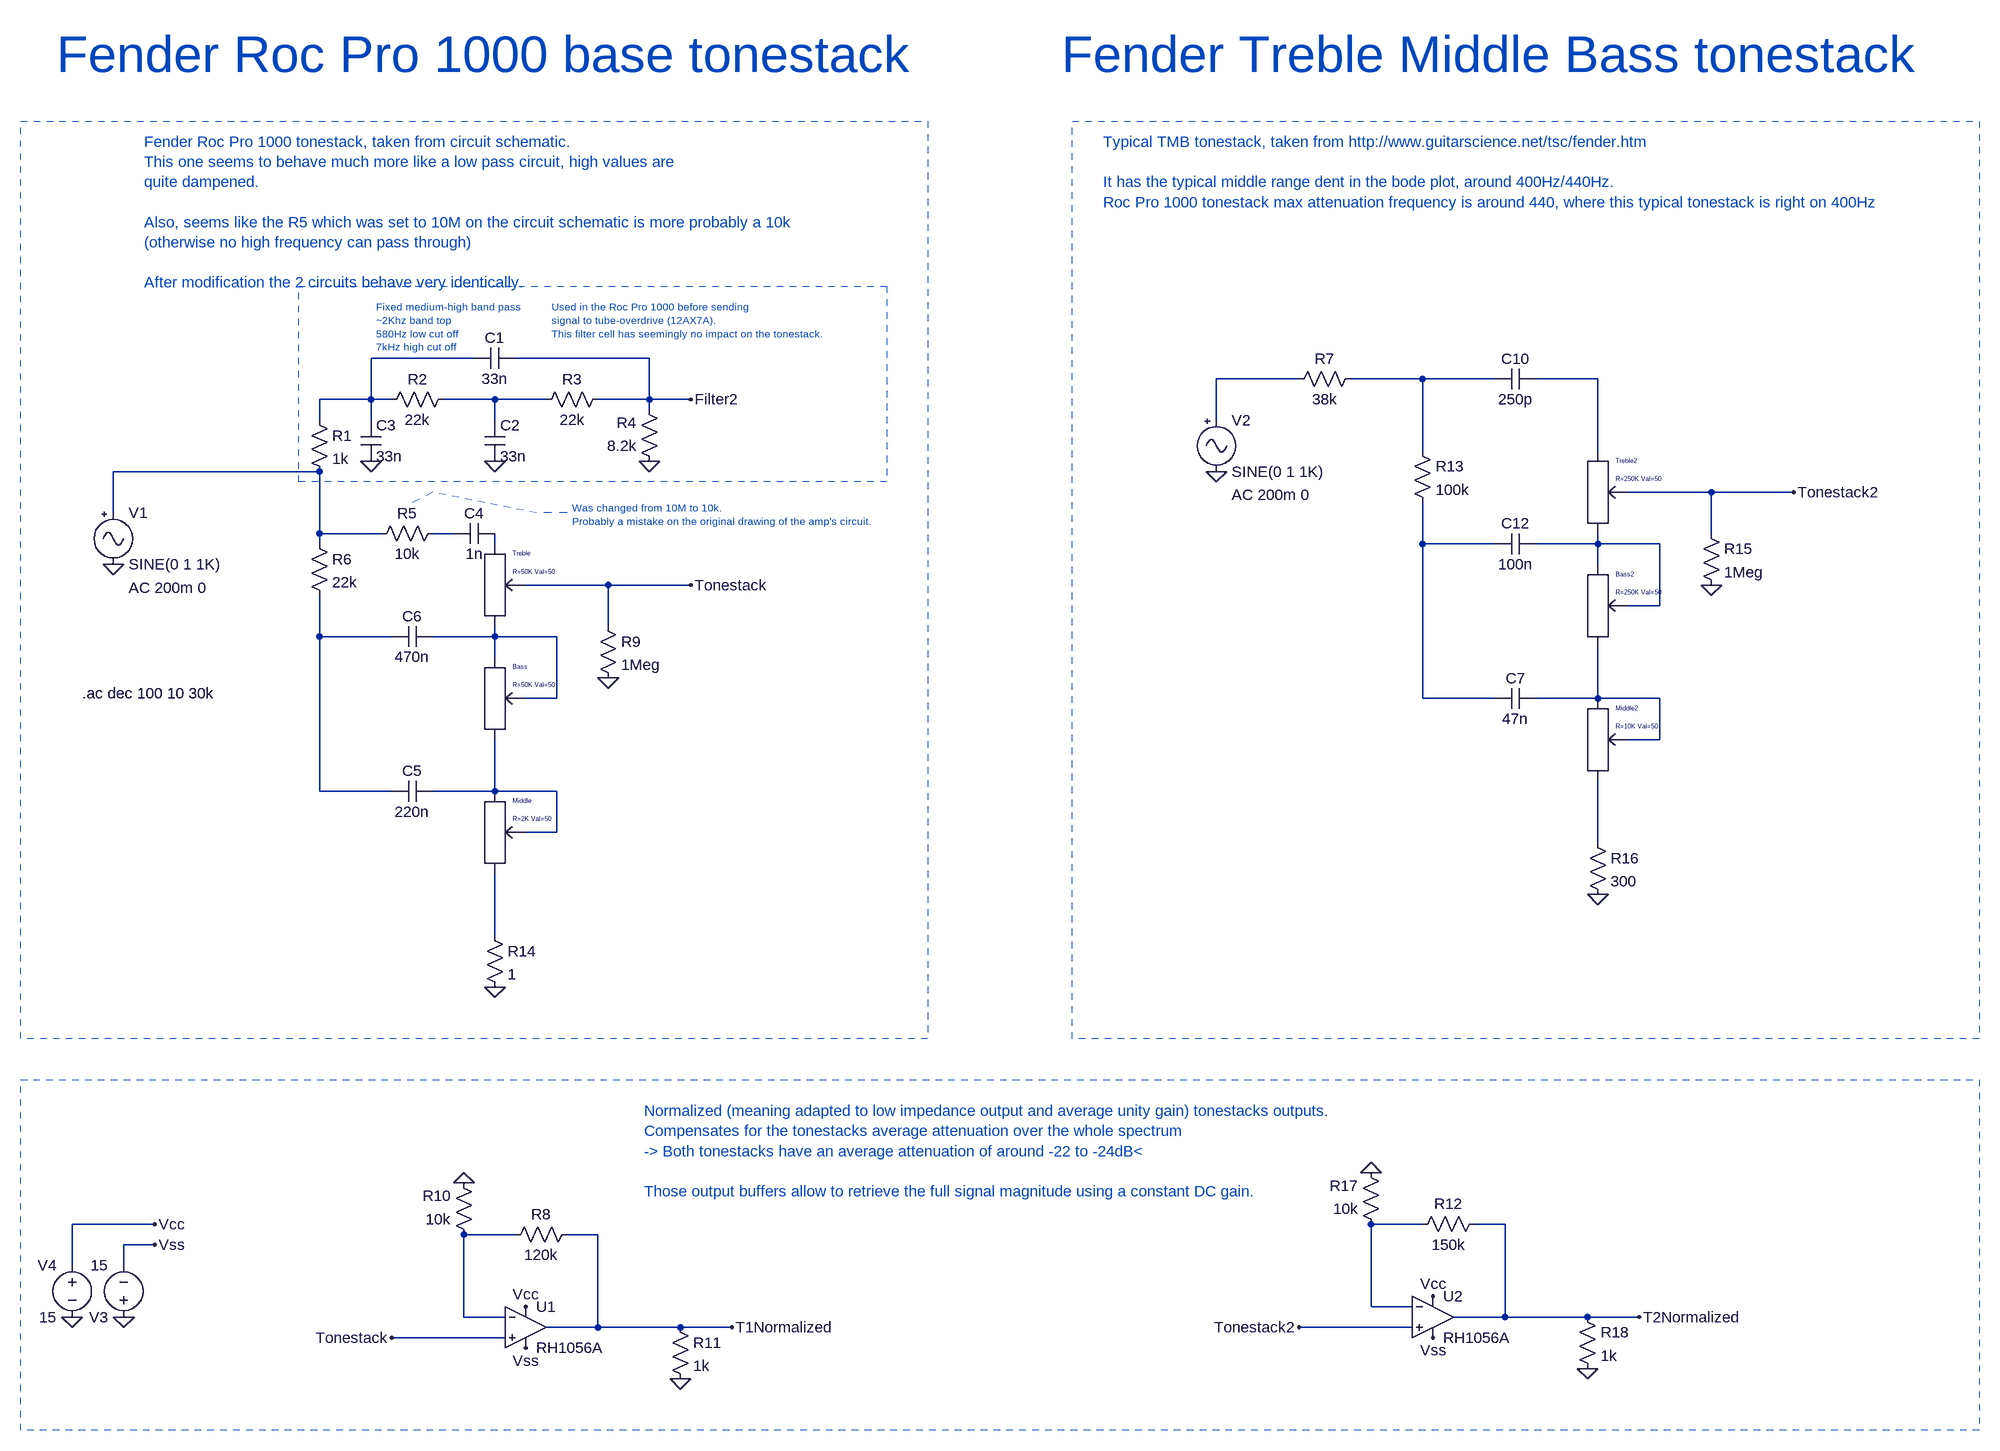
[diagram p0: schematic FenderToneStack.asc]
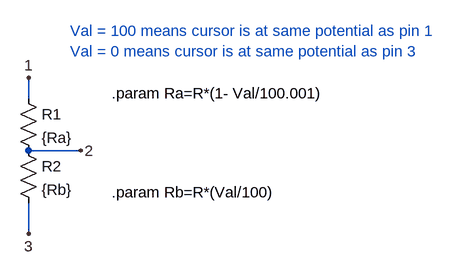
[diagram p1: sub-circuit potentiometer.asc]
FenderToneStack.asc, the LTspice schematic file:
Version 4
SHEET 1 3704 1716
WIRE 144 48 -16 48
WIRE 416 48 208 48
WIRE 1424 80 1296 80
WIRE 1616 80 1504 80
WIRE 1728 80 1616 80
WIRE 1888 80 1792 80
WIRE -16 112 -16 48
WIRE -16 112 -96 112
WIRE 16 112 -16 112
WIRE 176 112 96 112
WIRE 256 112 176 112
WIRE 416 112 416 48
WIRE 416 112 336 112
WIRE 480 112 416 112
WIRE 416 128 416 112
WIRE -96 144 -96 112
WIRE -16 144 -16 112
WIRE 176 144 176 112
WIRE 1296 144 1296 80
WIRE 1616 192 1616 80
WIRE 1888 192 1888 80
WIRE -96 224 -416 224
WIRE 2064 256 1936 256
WIRE 2192 256 2064 256
WIRE -416 288 -416 224
WIRE -96 320 -96 224
WIRE 0 320 -96 320
WIRE 112 320 80 320
WIRE 2064 320 2064 256
WIRE -96 336 -96 320
WIRE 176 336 176 320
WIRE 1616 336 1616 272
WIRE 1728 336 1616 336
WIRE 1888 336 1888 320
WIRE 1888 336 1792 336
WIRE 1984 336 1888 336
WIRE 1888 368 1888 336
WIRE 352 400 224 400
WIRE 480 400 352 400
WIRE 1984 432 1984 336
WIRE 1984 432 1936 432
WIRE 352 464 352 400
WIRE -96 480 -96 416
WIRE 16 480 -96 480
WIRE 176 480 176 464
WIRE 176 480 80 480
WIRE 272 480 176 480
WIRE 176 512 176 480
WIRE 272 576 272 480
WIRE 272 576 224 576
WIRE 1616 576 1616 336
WIRE 1728 576 1616 576
WIRE 1888 576 1888 496
WIRE 1888 576 1792 576
WIRE 1984 576 1888 576
WIRE 1984 640 1984 576
WIRE 1984 640 1936 640
WIRE -96 720 -96 480
WIRE 16 720 -96 720
WIRE 176 720 176 640
WIRE 176 720 80 720
WIRE 272 720 176 720
WIRE 272 784 272 720
WIRE 272 784 224 784
WIRE 1888 800 1888 704
WIRE 176 944 176 848
WIRE -352 1392 -480 1392
WIRE 1616 1392 1536 1392
WIRE 1744 1392 1696 1392
WIRE 208 1408 128 1408
WIRE 336 1408 288 1408
WIRE -352 1424 -400 1424
WIRE -480 1456 -480 1392
WIRE -400 1456 -400 1424
WIRE 1536 1520 1536 1392
WIRE 1600 1520 1536 1520
WIRE 128 1536 128 1408
WIRE 192 1536 128 1536
WIRE 1744 1536 1744 1392
WIRE 1744 1536 1664 1536
WIRE 1872 1536 1744 1536
WIRE 1952 1536 1872 1536
WIRE 336 1552 336 1408
WIRE 336 1552 256 1552
WIRE 464 1552 336 1552
WIRE 544 1552 464 1552
WIRE 1600 1552 1424 1552
WIRE 192 1568 16 1568
FLAG -16 208 0
FLAG 176 208 0
FLAG 416 208 0
FLAG 352 544 0
FLAG 176 1024 0
FLAG -416 368 0
FLAG 480 112 Filter2
FLAG 480 400 Tonestack
FLAG 2064 400 0
FLAG 1888 880 0
FLAG 1296 224 0
FLAG 2192 256 Tonestack2
FLAG 16 1568 Tonestack
FLAG 128 1328 0
FLAG -480 1536 0
FLAG -400 1536 0
FLAG -352 1392 Vcc
FLAG -352 1424 Vss
FLAG 224 1584 Vss
FLAG 224 1520 Vcc
FLAG 464 1632 0
FLAG 544 1552 T1Normalized
FLAG 1424 1552 Tonestack2
FLAG 1536 1312 0
FLAG 1632 1568 Vss
FLAG 1632 1504 Vcc
FLAG 1872 1616 0
FLAG 1952 1536 T2Normalized
SYMBOL Misc\\signal -416 272 R0
WINDOW 123 24 132 Left 2
WINDOW 39 0 0 Left 0
SYMATTR InstName V1
SYMATTR Value2 AC 200m 0
SYMBOL res -112 128 R0
SYMATTR InstName R1
SYMATTR Value 1k
SYMBOL cap 208 32 R90
WINDOW 0 0 32 VBottom 2
WINDOW 3 32 32 VTop 2
SYMATTR InstName C1
SYMATTR Value 33n
SYMBOL res 112 96 R90
WINDOW 0 0 56 VBottom 2
WINDOW 3 32 56 VTop 2
SYMATTR InstName R2
SYMATTR Value 22k
SYMBOL res 352 96 R90
WINDOW 0 0 56 VBottom 2
WINDOW 3 32 56 VTop 2
SYMATTR InstName R3
SYMATTR Value 22k
SYMBOL res 432 224 R180
WINDOW 0 36 76 Left 2
WINDOW 3 36 40 Left 2
SYMATTR InstName R4
SYMATTR Value 8.2k
SYMBOL cap 160 144 R0
SYMATTR InstName C2
SYMATTR Value 33n
SYMBOL cap -32 144 R0
SYMATTR InstName C3
SYMATTR Value 33n
SYMBOL res 96 304 R90
WINDOW 0 0 56 VBottom 2
WINDOW 3 32 56 VTop 2
SYMATTR InstName R5
SYMATTR Value 10k
SYMBOL cap 176 304 R90
WINDOW 0 0 32 VBottom 2
WINDOW 3 32 32 VTop 2
SYMATTR InstName C4
SYMATTR Value 1n
SYMBOL cap 80 704 R90
WINDOW 0 0 32 VBottom 2
WINDOW 3 32 32 VTop 2
SYMATTR InstName C5
SYMATTR Value 220n
SYMBOL cap 80 464 R90
WINDOW 0 0 32 VBottom 2
WINDOW 3 32 32 VTop 2
SYMATTR InstName C6
SYMATTR Value 470n
SYMBOL res -112 320 R0
SYMATTR InstName R6
SYMATTR Value 22k
SYMBOL res 336 448 R0
SYMATTR InstName R9
SYMATTR Value 1Meg
SYMBOL res 160 928 R0
SYMATTR InstName R14
SYMATTR Value 1
SYMBOL Potentiometer 176 400 R0
WINDOW 39 28 -21 Left 0
SYMATTR InstName Treble
SYMATTR SpiceLine R=50K Val=50
SYMBOL Potentiometer 176 576 R0
WINDOW 39 28 -21 Left 0
SYMATTR InstName Bass
SYMATTR SpiceLine R=50K Val=50
SYMBOL Potentiometer 176 784 R0
WINDOW 39 28 -21 Left 0
SYMATTR InstName Middle
SYMATTR SpiceLine R=2K Val=50
SYMBOL Misc\\signal 1296 128 R0
WINDOW 123 24 132 Left 2
WINDOW 39 0 0 Left 0
SYMATTR InstName V2
SYMATTR Value2 AC 200m 0
SYMBOL cap 1792 64 R90
WINDOW 0 0 32 VBottom 2
WINDOW 3 32 32 VTop 2
SYMATTR InstName C10
SYMATTR Value 250p
SYMBOL cap 1792 320 R90
WINDOW 0 0 32 VBottom 2
WINDOW 3 32 32 VTop 2
SYMATTR InstName C12
SYMATTR Value 100n
SYMBOL res 1600 176 R0
SYMATTR InstName R13
SYMATTR Value 100k
SYMBOL res 2048 304 R0
SYMATTR InstName R15
SYMATTR Value 1Meg
SYMBOL res 1872 784 R0
SYMATTR InstName R16
SYMATTR Value 300
SYMBOL Potentiometer 1888 256 R0
WINDOW 39 28 -21 Left 0
SYMATTR InstName Treble2
SYMATTR SpiceLine R=250K Val=50
SYMBOL Potentiometer 1888 432 R0
WINDOW 39 28 -21 Left 0
SYMATTR InstName Bass2
SYMATTR SpiceLine R=250K Val=50
SYMBOL Potentiometer 1888 640 R0
WINDOW 39 28 -21 Left 0
SYMATTR InstName Middle2
SYMBOL res 1520 64 R90
WINDOW 0 0 56 VBottom 2
WINDOW 3 32 56 VTop 2
SYMATTR InstName R7
SYMATTR Value 38k
SYMBOL cap 1792 560 R90
WINDOW 0 0 32 VBottom 2
WINDOW 3 32 32 VTop 2
SYMATTR InstName C7
SYMATTR Value 47n
SYMBOL OpAmps\\RH1056A 224 1488 R0
SYMATTR InstName U1
SYMBOL res 304 1392 R90
WINDOW 0 0 56 VBottom 2
WINDOW 3 32 56 VTop 2
SYMATTR InstName R8
SYMATTR Value 120k
SYMBOL res 144 1424 R180
WINDOW 0 36 76 Left 2
WINDOW 3 36 40 Left 2
SYMATTR InstName R10
SYMATTR Value 10k
SYMBOL voltage -400 1552 R180
WINDOW 123 0 0 Left 0
WINDOW 39 0 0 Left 0
SYMATTR InstName V3
SYMATTR Value 15
SYMBOL voltage -480 1440 M0
WINDOW 123 0 0 Left 0
WINDOW 39 0 0 Left 0
SYMATTR InstName V4
SYMATTR Value 15
SYMBOL res 448 1536 R0
SYMATTR InstName R11
SYMATTR Value 1k
SYMBOL OpAmps\\RH1056A 1632 1472 R0
SYMATTR InstName U2
SYMBOL res 1712 1376 R90
WINDOW 0 0 56 VBottom 2
WINDOW 3 32 56 VTop 2
SYMATTR InstName R12
SYMATTR Value 150k
SYMBOL res 1552 1408 R180
WINDOW 0 36 76 Left 2
WINDOW 3 36 40 Left 2
SYMATTR InstName R17
SYMATTR Value 10k
SYMBOL res 1856 1520 R0
SYMATTR InstName R18
SYMATTR Value 1k
TEXT -464 568 Left 2 !.ac dec 100 10 30k
TEXT -504 -424 Left 6 ;Fender Roc Pro 1000 base tonestack
TEXT 1056 -424 Left 6 ;Fender Treble Middle Bass tonestack
TEXT 1120 -288 Left 2 ;Typical TMB tonestack, taken from http://www.guitarscience.net/tsc/fender.htm\n \nIt has the typical middle range dent in the bode plot, around 400Hz/440Hz.\nRoc Pro 1000 tonestack max attenuation frequency is around 440, where this typical tonestack is right on 400Hz
TEXT -368 -288 Left 2 ;Fender Roc Pro 1000 tonestack, taken from circuit schematic.\nThis one seems to behave much more like a low pass circuit, high values are\nquite dampened.\n \nAlso, seems like the R5 which was set to 10M on the circuit schematic is more probably a 10k \n(otherwise no high frequency can pass through)\n \nAfter modification the 2 circuits behave very identically.
TEXT 296 280 Left 1 ;Was changed from 10M to 10k.\nProbably a mistake on the original drawing of the amp's circuit.
TEXT -8 -32 Left 1 ;Fixed medium-high band pass \n~2Khz band top\n580Hz low cut off\n7kHz high cut off
TEXT 264 -32 Left 1 ;Used in the Roc Pro 1000 before sending\nsignal to tube-overdrive (12AX7A).\nThis filter cell has seemingly no impact on the tonestack.
TEXT 408 1216 Left 2 ;Normalized (meaning adapted to low impedance output and average unity gain) tonestacks outputs.\nCompensates for the tonestacks average attenuation over the whole spectrum\n-> Both tonestacks have an average attenuation of around -22 to -24dB<\n \nThose output buffers allow to retrieve the full signal magnitude using a constant DC gain.
LINE Normal 80 256 48 272 2
LINE Normal 240 288 80 256 2
LINE Normal 288 288 240 288 2
LINE Normal 288 288 288 288 2
RECTANGLE Normal 848 1104 -560 -320 2
RECTANGLE Normal 2480 1104 1072 -320 2
RECTANGLE Normal 2480 1712 -560 1168 2
RECTANGLE Normal 784 240 -128 -64 2

potentiometer.asc, the sub-circuit schematic file:
Version 4
SHEET 1 908 680
WIRE 192 96 192 64
WIRE 272 176 192 176
WIRE 192 304 192 256
FLAG 192 64 1
FLAG 272 176 2
FLAG 192 304 3
SYMBOL res 176 80 R0
SYMATTR InstName R1
SYMATTR Value {Ra}
SYMBOL res 176 160 R0
SYMATTR InstName R2
SYMATTR Value {Rb}
TEXT 320 88 Left 2 !.param Ra=R*(1- Val/100.001)
TEXT 320 240 Left 2 !.param Rb=R*(Val/100)
TEXT 256 -8 Left 2 ;Val = 100 means cursor is at same potential as pin 1\nVal = 0 means cursor is at same potential as pin 3

The netlist it stands for:
* FenderToneStack.asc
V1 N006 0 SINE(0 1 1K) AC 200m 0
R1 N001 N006 1k
C1 Filter2 N001 33n
R2 N005 N001 22k
R3 Filter2 N005 22k
R4 0 Filter2 8.2k
C2 N005 0 33n
C3 N001 0 33n
R5 N007 N006 10k
C4 N008 N007 1n
C5 N014 N011 220n
C6 N012 N011 470n
R6 N006 N011 22k
R9 Tonestack 0 1Meg
R14 N016 0 1
XTreble N008 Tonestack N012 potentiometer params: R=50K Val=50
XBass N012 N012 N014 potentiometer params: R=50K Val=50
XMiddle N014 N014 N016 potentiometer params: R=2K Val=50
V2 N002 0 SINE(0 1 1K) AC 200m 0
C10 N004 N003 250p
C12 N010 N009 100n
R13 N003 N009 100k
R15 Tonestack2 0 1Meg
R16 N015 0 300
XTreble2 N004 Tonestack2 N010 potentiometer params: R=250K Val=50
XBass2 N010 N010 N013 potentiometer params: R=250K Val=50
XMiddle2 N013 N013 N015 potentiometer params: R=10K Val=50
R7 N003 N002 38k
C7 N013 N009 47n
XU1 Tonestack N018 Vcc Vss T1Normalized RH1056A  ; pins In+ In- V+ V- OUT
R8 T1Normalized N018 120k
R10 N018 0 10k
V3 0 Vss 15
V4 Vcc 0 15
R11 T1Normalized 0 1k
XU2 Tonestack2 N017 Vcc Vss T2Normalized RH1056A  ; pins In+ In- V+ V- OUT
R12 T2Normalized N017 150k
R17 N017 0 10k
R18 T2Normalized 0 1k

* block symbol definitions
.subckt potentiometer 1 2 3
R1 1 2 {Ra}
R2 2 3 {Rb}
.param Ra=R*(1- Val/100.001)
.param Rb=R*(Val/100)
* Val = 100 means cursor is at same potential as pin 1
* Val = 0 means cursor is at same potential as pin 3
.ends potentiometer

.ac dec 100 10 30k
* Fender Roc Pro 1000 base tonestack
* Fender Treble Middle Bass tonestack
* Typical TMB tonestack, taken from http://www.guitarscience.net/tsc/fender.htm
* It has the typical middle range dent in the bode plot, around 400Hz/440Hz.
* Roc Pro 1000 tonestack max attenuation frequency is around 440, where this typical tonestack is right on 400Hz
* Fender Roc Pro 1000 tonestack, taken from circuit schematic.
* This one seems to behave much more like a low pass circuit, high values are
* quite dampened.
* Also, seems like the R5 which was set to 10M on the circuit schematic is more probably a 10k
* (otherwise no high frequency can pass through)
* After modification the 2 circuits behave very identically.
* Was changed from 10M to 10k.
* Probably a mistake on the original drawing of the amp's circuit.
* Fixed medium-high band pass
* ~2Khz band top
* 580Hz low cut off
* 7kHz high cut off
* Used in the Roc Pro 1000 before sending
* signal to tube-overdrive (12AX7A).
* This filter cell has seemingly no impact on the tonestack.
* Normalized (meaning adapted to low impedance output and average unity gain) tonestacks outputs.
* Compensates for the tonestacks average attenuation over the whole spectrum
* -> Both tonestacks have an average attenuation of around -22 to -24dB<
* Those output buffers allow to retrieve the full signal magnitude using a constant DC gain.
.backanno
.end